# EAGLE design ICPotMoistureMeter (EAGLE 6.4)
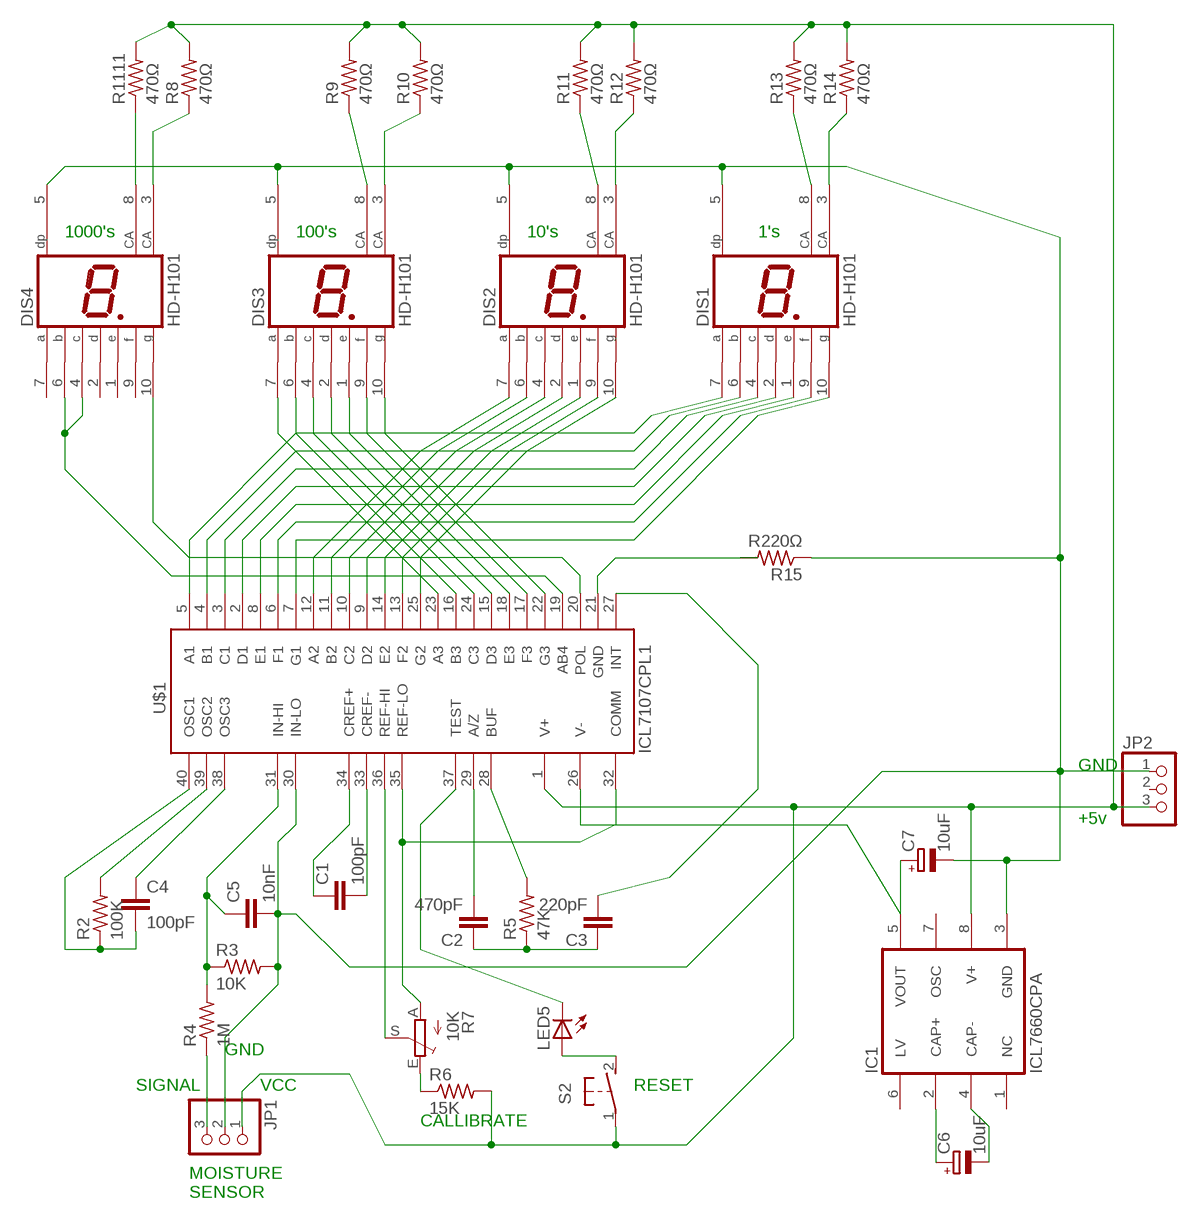
[diagram p0: schematic, sheet 1]

## Parts
C1  100pF  C-EU025-024X044  [C025-024X044]
C2  470pF  C-EU025-024X044  [C025-024X044]
C3  220pF  C-EU025-024X044  [C025-024X044]
C4  100pF  C-EU025-024X044  [C025-024X044]
C5  10nF  C-EU025-024X044  [C025-024X044]
C6  10uF  CPOL-EUE2-5  [E2-5]
C7  10uF  CPOL-EUE2-5  [E2-5]
DIS1  HD-H101  [HDSP-M]
DIS2  HD-H101  [HDSP-M]
DIS3  HD-H101  [HDSP-M]
DIS4  HD-H101  [HDSP-M]
IC1  ICL7660CPA  [DIL08]
JP1  PINHD-1X3/90  [1X03/90]
JP2  PINHD-1X3/90  [1X03/90]
LED5  LED3MM  [LED3MM]
R2  100K  R-US_0204/2V  [0204V]
R3  10K  R-US_0204/2V  [0204V]
R4  1M  R-US_0204/2V  [0204V]
R5  47K  R-US_0204/2V  [0204V]
R6  15K  R-US_0204/2V  [0204V]
R7  10K  TRIM_EU-CA6V  [CA6V]
R8  470Ω  R-US_0204/2V  [0204V]
R9  470Ω  R-US_0204/2V  [0204V]
R10  470Ω  R-US_0204/2V  [0204V]
R11  470Ω  R-US_0204/2V  [0204V]
R12  470Ω  R-US_0204/2V  [0204V]
R13  470Ω  R-US_0204/2V  [0204V]
R14  470Ω  R-US_0204/2V  [0204V]
R15  R220Ω  R-US_0204/2V  [0204V]
R1111  470Ω  R-US_0204/2V  [0204V]
S2  31-XX  [B3F-31XX]
U$1  ICL7107CPL1  [DIL40]

## Nets
N$1: DIS1.7(A) U$1.5(A1)
N$2: DIS1.6(B) U$1.4(B1)
N$3: DIS1.4(C) U$1.3(C1)
N$4: DIS1.2(D) U$1.2(D1)
N$5: DIS1.1(E) U$1.8(E1)
N$6: DIS1.9(F) U$1.6(F1)
N$7: DIS1.10(G) U$1.7(G1)
N$8: R2.2 U$1.39(OSC2)
N$9: C1.1 U$1.34(CREF+)
N$10: DIS2.7(A) U$1.12(A2)
N$11: C5.1 R3.1 R4.2 U$1.31(IN-HI)
N$12: DIS2.6(B) U$1.11(B2)
N$13: DIS2.4(C) U$1.10(C2)
N$14: JP1.3 R4.1
N$15: DIS2.2(D) U$1.9(D2)
N$16: DIS2.1(E) U$1.14(E2)
N$17: DIS2.9(F) U$1.13(F2)
N$18: DIS2.10(G) U$1.25(G2)
N$19: DIS3.7(A) U$1.23(A3)
N$20: DIS3.6(B) U$1.16(B3)
N$21: C1.2 U$1.33(CREF-)
N$22: DIS3.4(C) U$1.24(C3)
N$23: DIS3.2(D) U$1.15(D3)
N$24: DIS3.1(E) U$1.18(E3)
N$25: DIS3.9(F) U$1.17(F3)
N$26: DIS3.10(G) U$1.22(G3)
N$27: C4.2 R2.1 U$1.40(OSC1)
N$28: DIS4.4(C) DIS4.6(B) U$1.19(AB4)
N$29: DIS4.10(G) U$1.20(POL)
N$30: DIS4.8(CA) R1111.1
N$31: C3.2 U$1.27(INT)
N$32: DIS4.3(CA) R8.1
N$33: DIS3.8(CA) R9.1
N$34: DIS3.3(CA) R10.1
N$35: R5.2 U$1.28(BUF)
N$36: C4.1 U$1.38(OSC3)
N$37: C2.1 C3.1 R5.1
N$38: C2.2 U$1.29(A/Z)
N$39: C7.+ IC1.5(VOUT) U$1.26(V-)
N$40: C5.2 C7.- DIS1.5(DP) DIS2.5(DP) DIS3.5(DP) DIS4.5(DP) IC1.3(GND) JP1.2 JP2.1 R3.2 R15.1 U$1.30(IN-LO)
N$41: R7.A U$1.32(COMM) U$1.35(REF-LO)
N$42: R7.S U$1.36(REF-HI)
N$43: LED5.K(C) U$1.37(TEST)
N$44: R6.1 R7.E
N$45: DIS2.8(CA) R11.1
N$46: DIS2.3(CA) R12.1
N$47: DIS1.8(CA) R13.1
N$48: DIS1.3(CA) R14.1
N$49: LED5.A S2.2(S)
N$50: R15.2 U$1.21(GND)
N$51: IC1.8(V+) JP1.1 JP2.3 R6.2 R8.2 R9.2 R10.2 R11.2 R12.2 R13.2 R14.2 R1111.2 S2.1(P) U$1.1(V+)
N$52: C6.+ IC1.2(CAP+)
N$53: C6.- IC1.4(CAP-)
Unconnected: DIS4.1(E) DIS4.2(D) DIS4.7(A) DIS4.9(F) IC1.1(NC) IC1.6(LV) IC1.7(OSC) JP2.2

## Notes on the sheet
- 1000's | 100's | 10's | 1's
- GND
- +5v
- GND
- SIGNAL | VCC | RESET
- CALLIBRATE
- MOISTURE
  SENSOR

## Library data of the parts
C1-C5 = resistor:C-EU: CAPACITOR, European symbol
C6 C7 = rcl:CPOL-EU: POLARIZED CAPACITOR, European symbol
DIS1-DIS4 = display-hp:HD-H101: LED DISPLAY 1-character 7 segment, decimal point right; OC_FARNELL: unknown; OC_NEWARK: unknown
IC1 = maxim-3:ICL7660CPA: VOLTAGE CONVERTER
JP1 JP2 = pinhead:PINHD-1X3: PIN HEADER
LED5 = led:LED: LED OSRAM: - CHIPLED LG R971, LG N971, LY N971, LG Q971, LY Q971, LO R971, LY R971 LH N974, LH R974 LS Q976, LO Q976, LY Q976 LO Q996 - Hyper CHIPLED LW Q18S LB Q993, LB Q99A, LB R99A - SideLED LS A670, LO A670, LY A670, LG A670, LP A670 LB A673, LV A673, LT A673, LW A673 LH A674 LY A675 LS A676, LA A676, LO A676, LY A676, LW A676 LS A679, LY A679, LG A679 - Hyper Micro SIDELED® LS Y876, LA Y876, LO Y876, LY Y876 LT Y87S - SmartLED LW L88C, LW L88S LB L89C, LB L89S, LG L890 LS L89K, LO L89K, LY L89K LS L896, LA L896, LO L896, LY L896 - TOPLED LS T670, LO T670, LY T670, LG T670, LP T670 LSG T670, LSP T670, LSY T670, LOP T670, LYG T670 LG T671, LOG T671, LSG T671 LB T673, LV T673, LT T673, LW T673 LH T674 LS T676, LA T676, LO T676, LY T676, LB T676, LH T676, LSB T676, LW T676 LB T67C, LV T67C, LT T67C, LS T67K, LO T67K, LY T67K, LW E67C LS E67B, LA E67B, LO E67B, LY E67B, LB E67C, LV E67C, LT E67C LW T67C LS T679, LY T679, LG T679 LS T770, LO T770, LY T770, LG T770, LP T770 LB T773, LV T773, LT T773, LW T773 LH T774 LS E675, LA E675, LY E675, LS T675 LS T776, LA T776, LO T776, LY T776, LB T776 LHGB T686 LT T68C, LB T68C - Hyper Mini TOPLED® LB M676 - Mini TOPLED Santana® LG M470 LS M47K, LO M47K, LY M47K Source: http://www.osram.convergy.de LUXEON: - LUMILED® LXK2-PW12-R00, LXK2-PW12-S00, LXK2-PW14-U00, LXK2-PW14-V00 LXK2-PM12-R00, LXK2-PM12-S00, LXK2-PM14-U00 LXK2-PE12-Q00, LXK2-PE12-R00, LXK2-PE12-S00, LXK2-PE14-T00, LXK2-PE14-U00 LXK2-PB12-K00, LXK2-PB12-L00, LXK2-PB12-M00, LXK2-PB14-N00, LXK2-PB14-P00, LXK2-PB14-Q00 LXK2-PR12-L00, LXK2-PR12-M00, LXK2-PR14-Q00, LXK2-PR14-R00 LXK2-PD12-Q00, LXK2-PD12-R00, LXK2-PD12-S00 LXK2-PH12-R00, LXK2-PH12-S00 LXK2-PL12-P00, LXK2-PL12-Q00, LXK2-PL12-R00 Source: www.luxeon.com KINGBRIGHT: KA-3528ASYC Source: www.kingbright.com
R2-R6 R8-R15 R1111 = resistor:R-US_: RESISTOR, American symbol
R7 = pot:TRIM_EU-: POTENTIOMETER
S2 = switch-omron:31-XX: OMRON SWITCH; MPN: B3F-3100; OC_FARNELL: 959704; OC_NEWARK: 36M3582
U$1 = maxim-3:ICL7107CPL: LED DRIVER

## Board
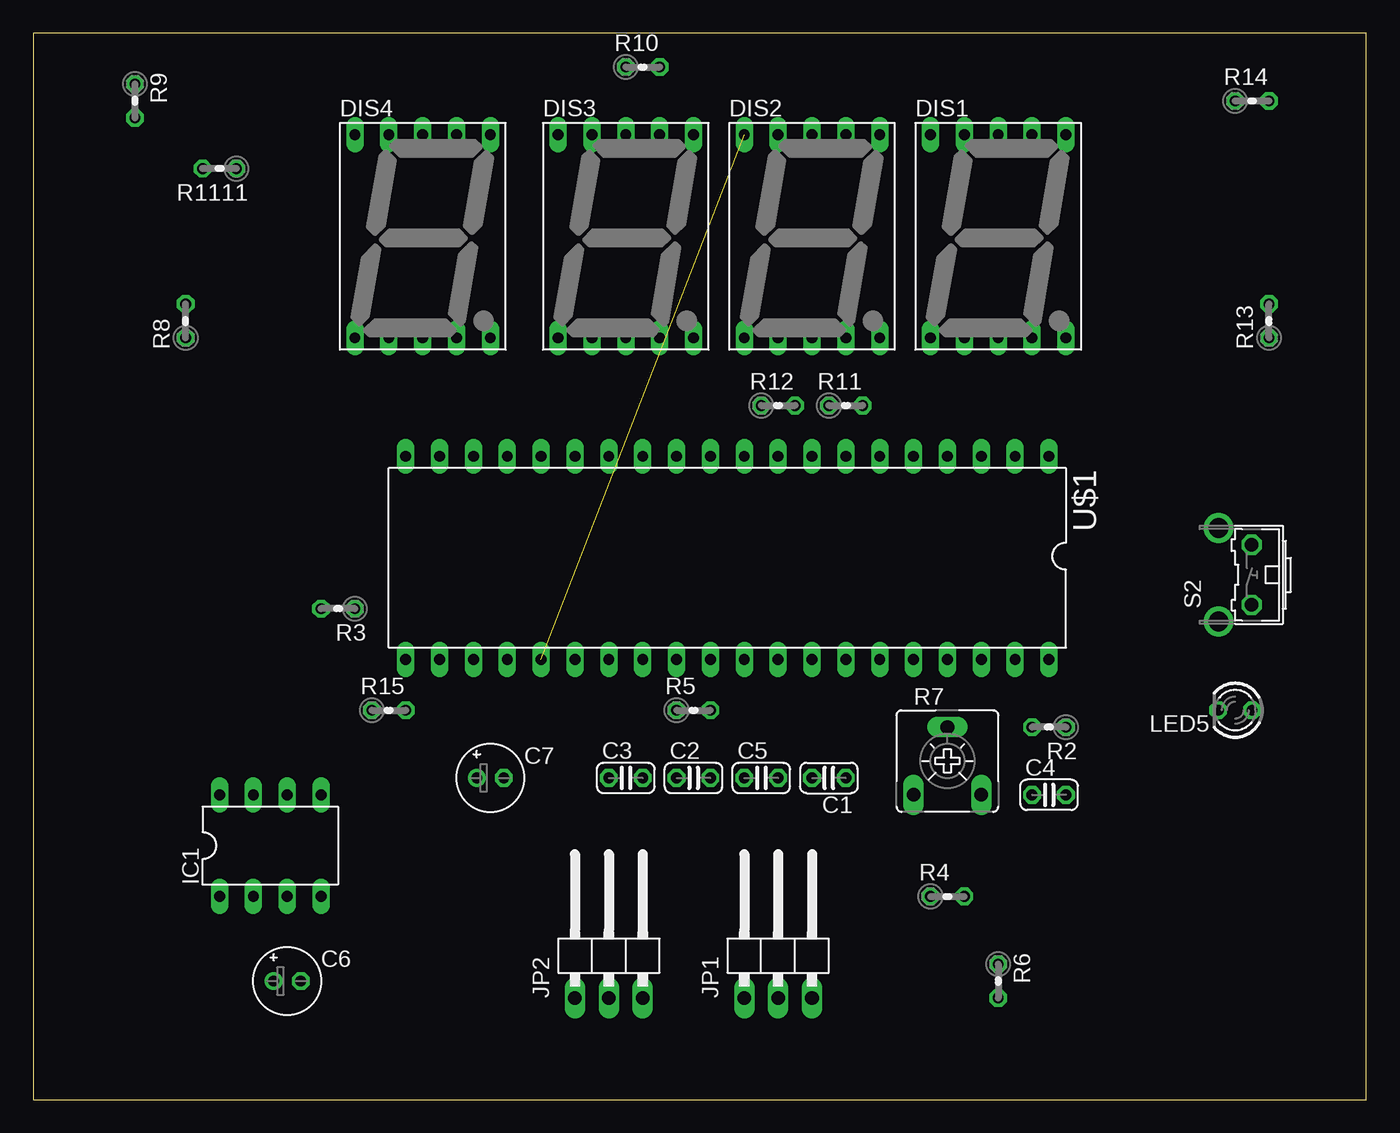
[diagram p1: board, top side]
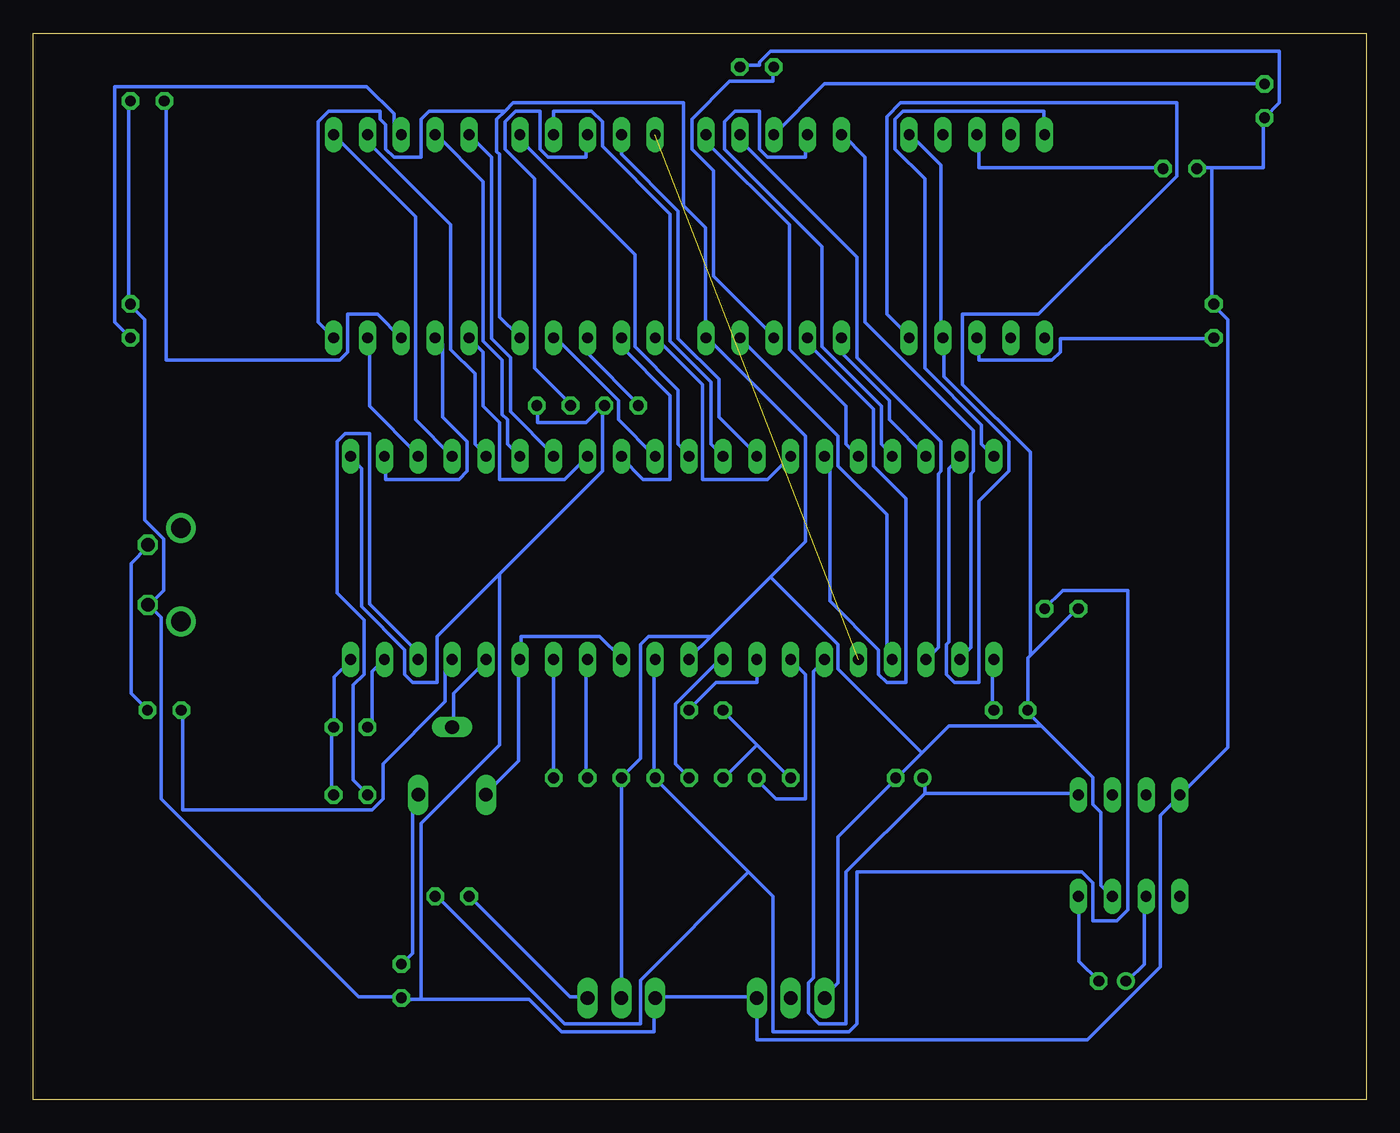
[diagram p2: board, bottom side, seen from below]

Size 100 x 80 mm. Coordinates in mm from the lower left corner, seen from the top.
Outline: 0,0 100,0 100,80 0,80 0,0
Copper layers (1*16): Top 0.035mm / dielectric 1.5mm / Bottom 0.035mm
Design rules "default": minimum track width 10mil, minimum drill 24mil, track to track 8mil, track to pad 8mil, pad to pad 8mil, via to via 8mil, smd to smd 8mil, copper to edge 40mil, drill to drill 8mil, minimum pad ring 10mil, minimum via ring 8mil, stop-mask expansion 4mil, vias tented up to drill 0mil, thermal gap 10mil

### Footprints (pad centres in the part's own frame; a part is rotated, then mirrored left to right if it is on the bottom)
C025-024X044 = drill 0.813 octagon: 1 -1.27,0; 2 1.27,0
E2-5 = drill 0.813 pad 1.27: + -1.016,0 | drill 0.813 pad 1.27 octagon: - 1.016,0
HDSP-M = drill 0.813 long: 1 -5.08,-7.62; 2 -2.54,-7.62; 3 0,-7.62; 4 2.54,-7.62; 5 5.08,-7.62; 6 5.08,7.62; 7 2.54,7.62; 8 0,7.62; 9 -2.54,7.62; 10 -5.08,7.62
DIL08 = drill 0.813 long: 1 -3.81,-3.81; 2 -1.27,-3.81; 3 1.27,-3.81; 4 3.81,-3.81; 5 3.81,3.81; 6 1.27,3.81; 7 -1.27,3.81; 8 -3.81,3.81
1X03/90 = drill 1.016 long: 1 -2.54,-3.81; 2 0,-3.81; 3 2.54,-3.81
LED3MM = drill 0.813 octagon: A -1.27,0; K 1.27,0
0204V = drill 0.813 octagon: 1 -1.27,0; 2 1.27,0
CA6V = drill 1.016 long: A -2.54,-2.54; E 2.54,-2.54; S 0,2.54
B3F-31XX = drill 1.016 octagon: 1 -2.261,-1.245; 2 2.261,-1.245 | drill 1.499 pad 2.159: 3 -3.505,1.245; 4 3.505,1.245
DIL40 = drill 0.813 long: 1 -24.13,-7.62; 2 -21.59,-7.62; 3 -19.05,-7.62; 4 -16.51,-7.62; 5 -13.97,-7.62; 6 -11.43,-7.62; 7 -8.89,-7.62; 8 -6.35,-7.62; 9 -3.81,-7.62; 10 -1.27,-7.62; 11 1.27,-7.62; 12 3.81,-7.62; 13 6.35,-7.62; 14 8.89,-7.62; 15 11.43,-7.62; 16 13.97,-7.62; 17 16.51,-7.62; 18 19.05,-7.62; 19 21.59,-7.62; 20 24.13,-7.62; 21 24.13,7.62; 22 21.59,7.62; 23 19.05,7.62; 24 16.51,7.62; 25 13.97,7.62; 26 11.43,7.62; 27 8.89,7.62; 28 6.35,7.62; 29 3.81,7.62; 30 1.27,7.62; 31 -1.27,7.62; 32 -3.81,7.62; 33 -6.35,7.62; 34 -8.89,7.62; 35 -11.43,7.62; 36 -13.97,7.62; 37 -16.51,7.62; 38 -19.05,7.62; 39 -21.59,7.62; 40 -24.13,7.62

### Placement (x,y rotation side)
C1  59.69,24.13 180 top
C2  49.53,24.13 0 top
C3  44.45,24.13 0 top
C4  76.2,22.86 0 top
C5  54.61,24.13 0 top
C6  19.05,8.89 0 top
C7  34.29,24.13 0 top
DIS1  72.39,64.77 0 top
DIS2  58.42,64.77 0 top
DIS3  44.45,64.77 0 top
DIS4  29.21,64.77 0 top
IC1  17.78,19.05 0 top
JP1  55.88,11.43 0 top
JP2  43.18,11.43 0 top
LED5  90.17,29.21 180 top
R2  76.2,27.94 180 top
R3  22.86,36.83 180 top
R4  68.58,15.24 0 top
R5  49.53,29.21 0 top
R6  72.39,8.89 270 top
R7  68.58,25.4 0 top
R8  11.43,58.42 90 top
R9  7.62,74.93 270 top
R10  45.72,77.47 0 top
R11  60.96,52.07 0 top
R12  55.88,52.07 0 top
R13  92.71,58.42 90 top
R14  91.44,74.93 0 top
R15  26.67,29.21 0 top
R1111  13.97,69.85 180 top
S2  90.17,39.37 90 top
U$1  52.07,40.64 180 top

### Tracks (layer width: path | path; a pad name or v marks a point on that pad's centre or on a via)
N$1
  Bottom 0.254: U$1.5 66.04,48.36 66.85,49.17 66.85,54.46 68.68,56.29 68.68,65.63 74.78,71.73 74.78,72.34 DIS1.7
N$2
  Bottom 0.254: U$1.4 71.32,51 71.32,66.24 DIS1.6
N$3
  Bottom 0.254: U$1.3 71.12,48.36 74.78,52.02 74.78,57.1 DIS1.4
N$4
  Bottom 0.254: DIS1.2 69.7,57.1 69.29,56.69 69.29,51.21 67.46,49.38 67.46,47.14 68.07,46.53 73.56,46.53 73.56,48.16 U$1.2
N$5
  Bottom 0.254: U$1.8 60.15,46.53 65.02,46.53 65.02,50.8 66.24,52.02 66.24,56.08 DIS1.1
N$6
  Bottom 0.254: U$1.6 64.41,49.17 64.41,51 64.82,51.41 64.82,55.47 66.24,56.9 66.24,68.89 69.7,72.34 DIS1.9
N$7
  Bottom 0.254: DIS1.10 65.63,70.71 65.63,57.1 64.21,55.68 64.21,51.61 60.96,48.36 U$1.7
N$8
  Bottom 0.254: U$1.39 74.57,32.11 74.57,28.25 74.78,28.04 R2.2
N$9
  Bottom 0.254: U$1.34 C1.1
N$10
  Bottom 0.254: U$1.12 49.17,49.17 49.17,53.85 52.22,56.9 52.22,66.45 57.3,71.53 57.3,73.36 58.12,74.17 60.96,74.17 DIS2.7
N$11
  Bottom 0.254: U$1.31 53.44,32.92 53.44,24.18 C5.1 53.24,23.98 46.33,17.07 | R3.1 22.76,38.2 17.88,38.2 17.88,14.22 18.69,13.41 20.52,13.41 20.52,16.26 21.34,17.07 38.2,17.07 38.2,5.69 38.81,5.08 44.5,5.08 44.5,15.24 46.33,17.07 | 46.33,17.07 54.46,8.94 54.46,5.69 60.15,5.69 69.7,15.24 R4.2
N$12
  Bottom 0.254: U$1.11 50.8,48.36 51.61,49.17 51.61,53.24 54.86,56.49 54.86,63.4 63.4,71.93 63.4,72.34 DIS2.6
N$13
  Bottom 0.254: U$1.10 56.08,51 56.08,52.43 60.96,57.3 DIS2.4
N$14
  Bottom 0.254: R4.1 67.26,15.24 59.74,7.72 58.52,7.72 JP1.3
N$15
  Bottom 0.254: DIS2.2 55.88,56.49 52.22,52.83 52.22,46.53 54.25,46.53 55.88,48.16 U$1.9
N$16
  Bottom 0.254: U$1.14 44.91,46.53 49.78,46.53 49.78,53.65 53.24,57.1 DIS2.1
N$17
  Bottom 0.254: DIS2.9 55.88,70.92 51.61,66.65 51.61,57.1 48.56,54.05 48.56,51.21 45.72,48.36 U$1.13
N$18  (1 unrouted)
N$19
  Bottom 0.254: U$1.23 32.11,33.93 32.11,46.94 31.9,47.14 31.9,49.38 38.2,55.68 38.2,63.2 46.94,71.93 46.94,72.34 DIS3.7
N$20
  Bottom 0.254: U$1.16 39.01,49.17 39.01,52.02 43.28,56.29 43.28,65.63 49.38,71.73 49.38,72.34 DIS3.6
N$21
  Bottom 0.254: C1.2 58.52,24.18 58.52,32.92 U$1.33
N$22
  Bottom 0.254: DIS3.4 39.62,49.78 39.62,47.55 35.97,43.89 35.97,33.53 35.56,33.12 U$1.24
N$23
  Bottom 0.254: U$1.15 40.64,48.16 40.23,47.75 40.23,37.39 36.58,33.73 36.58,31.9 35.97,31.29 34.54,31.29 34.54,45.11 36.98,47.55 36.98,51.82 41.86,56.69 41.86,57.1 DIS3.2
N$24
  Bottom 0.254: U$1.18 35.76,51 35.76,52.43 39.22,55.88 39.22,57.1 DIS3.1
N$25
  Bottom 0.254: U$1.17 35.56,48.36 36.37,49.17 36.37,52.02 40.84,56.49 40.84,64.01 48.16,71.32 48.16,73.36 47.35,74.17 45.52,74.17 45.52,71.32 44.91,70.71 42.06,70.71 42.06,72.34 DIS3.9
N$26
  Bottom 0.254: U$1.22 30.48,33.12 29.67,33.93 29.67,46.94 29.46,47.14 29.46,50.19 37.59,58.32 37.59,70.71 39.22,72.34 DIS3.10
N$27
  Bottom 0.254: C4.2 77.62,22.96 77.62,27.84 R2.1 77.42,28.04 77.42,31.7 76.2,32.92 U$1.40
N$28
  Bottom 0.254: U$1.19 30.48,48.16 31.29,47.35 31.29,34.34 31.5,34.14 31.5,31.9 30.89,31.29 29.06,31.29 29.06,44.91 26.82,47.14 26.82,49.38 31.7,54.25 31.7,57.1 DIS4.4 31.9,57.3 31.9,70.1 34.14,72.34 DIS4.6
N$29
  Bottom 0.254: U$1.20 28.85,49.17 28.85,50.6 33.12,54.86 33.12,69.09 35.36,71.32 35.36,73.56 34.75,74.17 24.18,74.17 24.18,72.54 DIS4.10
N$30
  Bottom 0.254: R1111.1 15.24,69.9 29.06,69.9 29.06,72.34 DIS4.8
N$31
  Bottom 0.254: U$1.27 42.06,31.9 42.06,22.55 44.3,22.55 45.72,23.98 C3.2
N$32
  Bottom 0.254: R8.1 11.58,57.1 22.96,57.1 22.96,56.08 23.57,55.47 29.06,55.47 29.06,57.1 DIS4.3
N$33
  Bottom 0.254: DIS3.8 40.64,76.2 R9.1
N$34
  Bottom 0.254: DIS3.3 44.5,57.3 48.97,61.77 48.97,69.7 50.6,71.32 50.6,73.56 47.75,76.4 44.5,76.4 44.5,77.42 R10.1
N$35
  Bottom 0.254: U$1.28 45.72,31.29 48.77,31.29 50.8,29.26 R5.2
N$36
  Bottom 0.254: U$1.38 71.12,33.53 74.78,37.19 74.78,49.99 76.61,49.99 77.22,49.38 77.22,38 75.18,35.97 75.18,31.9 76,31.09 76,23.98 74.98,22.96 C4.1
N$37
  Bottom 0.254: 45.72,26.62 48.16,29.06 R5.1 | 45.72,26.62 43.28,24.18 C3.1 | 45.72,26.62 48.16,24.18 C2.1
N$38
  Bottom 0.254: C2.2 50.8,24.18 51.82,25.2 51.82,29.67 48.36,33.12 U$1.29
N$39
  Bottom 0.254: 33.12,22.96 21.74,22.96 IC1.5 | 33.12,22.96 33.12,23.98 C7.+ | 33.12,22.96 39.01,17.07 39.01,5.69 41.05,5.69 41.86,6.5 41.86,8.74 41.45,9.14 41.45,32.11 40.64,32.92 U$1.26
N$40
  Bottom 0.254: 24.38,28.04 25.4,29.06 R15.1 25.4,33.12 25.2,33.33 | 24.38,28.04 20.52,24.18 20.52,22.15 19.91,21.54 19.91,16.05 19.1,15.24 IC1.3 | 33.33,26.01 31.29,28.04 24.38,28.04 | 33.33,26.01 35.15,24.18 C7.- 35.36,23.98 39.62,19.71 39.62,8.74 40.64,7.72 JP2.1 | 25.2,33.33 21.74,36.78 R3.2 | 25.2,33.33 25.2,48.56 30.28,53.65 30.28,58.93 24.59,58.93 14.22,69.29 14.22,74.78 34.95,74.78 35.97,73.76 35.97,58.93 34.34,57.3 DIS4.5 | JP1.2 C5.2 55.88,24.18 54.46,25.6 54.46,34.14 53.85,34.75 49.17,34.75 | 49.17,34.75 50.8,33.12 U$1.30 | 49.17,34.75 44.7,39.22 | 44.7,39.22 42.06,41.86 42.06,49.78 49.38,57.1 DIS3.5 49.58,57.3 49.58,65.43 51.21,67.06 51.21,74.78 64.01,74.78 64.62,74.17 | 64.62,74.17 65.23,73.56 65.23,71.12 65.02,70.92 65.02,58.73 63.6,57.3 DIS2.5 | DIS1.5 78.64,58.32 78.64,73.36 77.83,74.17 73.97,74.17 73.97,73.56 73.56,73.15 73.56,71.32 72.95,70.71 70.92,70.71 70.92,73.56 70.31,74.17 64.62,74.17 | 33.33,26.01 39.62,32.31 39.62,34.14 44.7,39.22
N$41
  Bottom 0.254: U$1.32 55.88,33.12 57.51,34.75 63.4,34.75 63.4,33.12 U$1.35 63.6,32.92 63.6,25.4 66.04,22.96 R7.A
N$42
  Bottom 0.254: U$1.36 66.04,32.92 68.48,30.48 68.48,28.04 R7.S
N$43
  Bottom 0.254: U$1.37 69.09,32.51 69.09,29.87 73.76,25.2 73.76,22.55 74.57,21.74 88.8,21.74 88.8,29.06 LED5.K
N$44
  Bottom 0.254: R6.1 72.34,10.16 71.53,10.97 71.53,22.35 71.12,22.76 R7.E
N$45
  Bottom 0.254: R11.1 59.74,52.22 62.38,54.86 62.38,69.09 64.62,71.32 64.62,73.36 63.8,74.17 61.98,74.17 61.98,71.32 61.37,70.71 58.52,70.71 58.52,72.34 DIS2.8
N$46
  Bottom 0.254: R12.1 54.66,52.22 58.32,55.88 58.32,57.1 DIS2.3
N$47
  Bottom 0.254: DIS1.8 72.95,72.95 72.95,73.97 74.98,76 93.88,76 93.88,58.32 R13.1
N$48
  Bottom 0.254: DIS1.3 74.17,58.93 76.4,58.93 76.4,56.08 77.01,55.47 90.02,55.47 90.02,74.78 R14.1
N$49
  Bottom 0.254: LED5.A 91.44,29.26 92.66,30.48 92.66,40.23 91.44,41.45 S2.2
N$50
  Bottom 0.254: R15.2 28.04,29.26 28.04,32.92 U$1.21
N$51
  Bottom 0.254: 11.58,69.9 7.72,69.9 7.72,73.56 R9.2 6.5,74.78 6.5,78.64 44.7,78.64 45.52,77.83 45.52,77.62 46.94,77.62 R10.2 | 11.58,69.9 12.6,69.9 R1111.2 | 11.58,69.9 11.58,59.74 R8.2 11.38,59.54 10.36,58.52 10.36,26.42 13.82,22.96 IC1.8 14.02,22.76 15.44,21.34 15.44,9.96 20.93,4.47 45.72,4.47 JP2.3 45.72,7.72 53.24,7.72 JP1.1 53.44,7.52 53.44,5.08 60.35,5.08 62.79,7.52 70.92,7.52 | R14.2 92.86,74.78 92.86,59.74 R13.2 92.66,59.54 91.64,58.52 91.64,43.48 90.22,42.06 90.22,38.2 91.24,37.19 S2.1 91.24,36.98 90.42,36.17 90.42,22.55 75.59,7.72 72.54,7.72 R6.2 72.34,7.52 70.92,7.52 | 57.3,52.02 58.52,50.8 62.18,50.8 62.18,52.02 R11.2 | 65.02,39.42 57.3,47.14 57.3,52.02 | 65.02,39.42 69.7,34.75 69.7,31.29 71.53,31.29 72.14,31.9 72.14,33.73 75.39,36.98 75.39,47.35 76.2,48.16 U$1.1 | 57.3,52.02 R12.2 | 70.92,7.52 70.92,20.73 65.02,26.62 65.02,39.42
N$52
  Bottom 0.254: C6.+ 17.88,8.94 16.66,10.16 16.66,15.24 IC1.2
N$53
  Bottom 0.254: C6.- 21.54,10.36 21.54,15.24 IC1.4